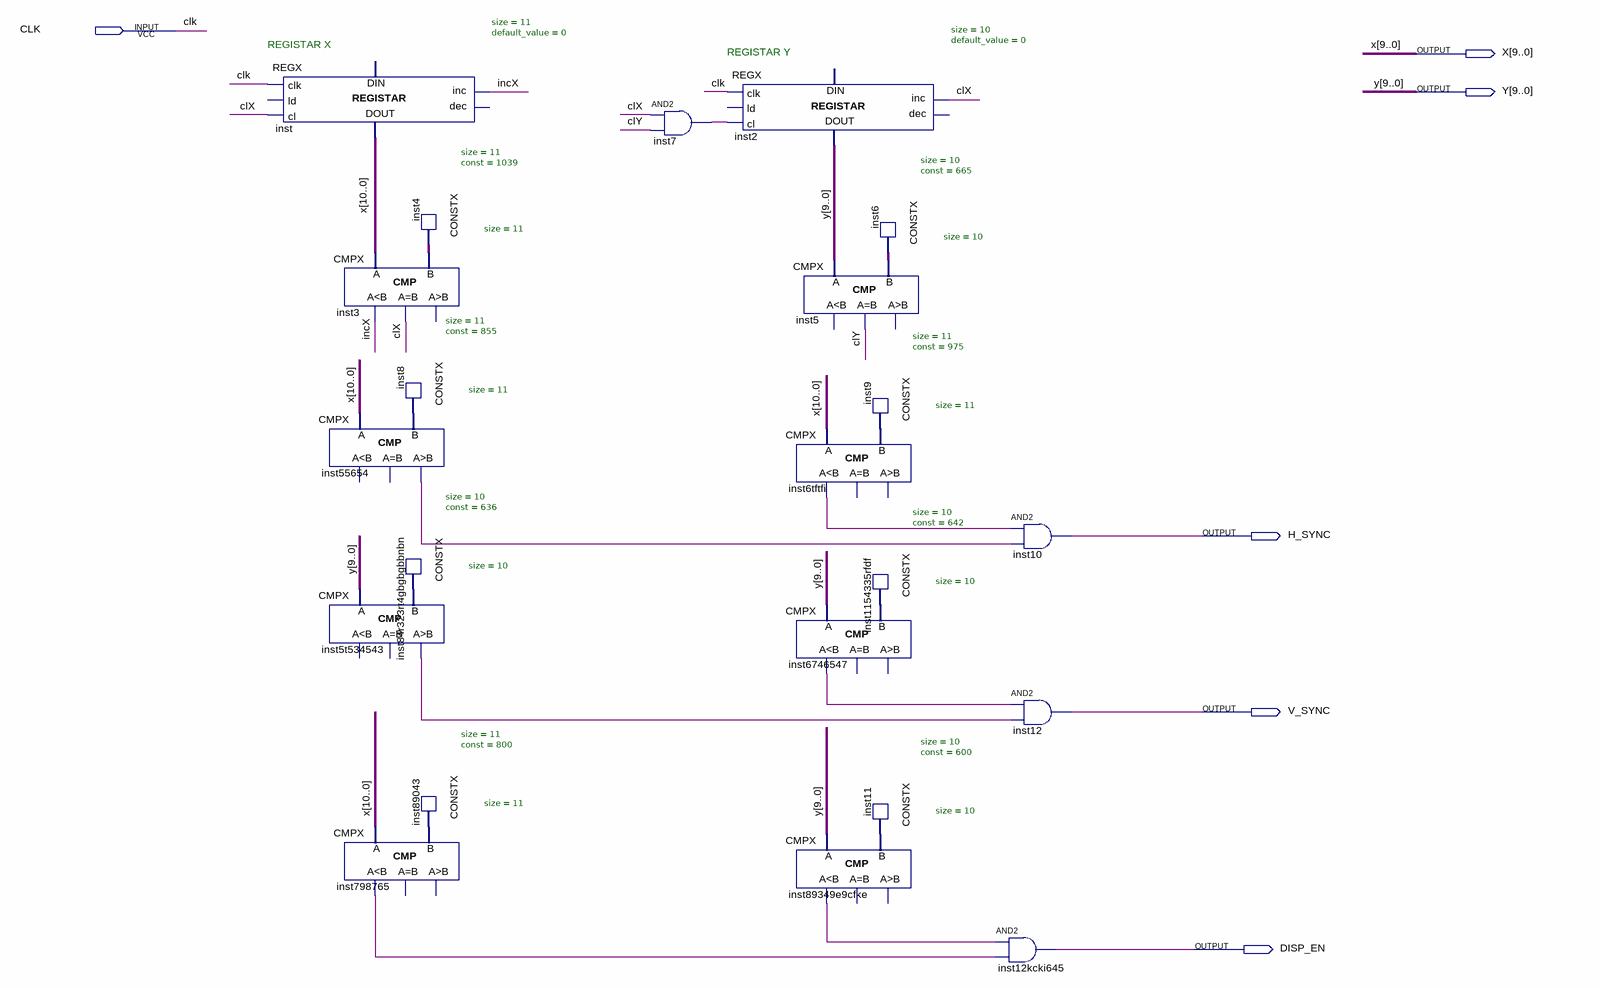
[diagram p0: schematic sheet]
// Quartus schematic VGAController.bdf as structural Verilog: 22 symbols, 6 pins
module VGAController (
  input  CLK,
  output [10:0] X,
  output [9:0] Y,
  output H_SYNC,
  output V_SYNC,
  output DISP_EN
);

  wire clX, clY, incX, inst5t534543_gr, inst6tftfi_ls, inst7_out, inst55654_gr, inst89349e9cfke_ls,
       inst798765_ls, inst6746547_ls;
  wire [9:0] inst6_data, inst11_data, inst84r323rt4gbgbgbbnbn_data, inst1154335rfdf_data;
  wire [10:0] inst4_data, inst8_data, inst9_data, inst89043_data;

  REGX #(.size(11), .default_value(0)) inst (.clk(CLK), .cl(clX), .inc(incX), .data_out(X));  // open: ld, dec, data_in
  CMPX #(.size(11)) inst3 (.A(X), .B(inst4_data), .ls(incX), .eq(clX));  // open: gr
  CMPX #(.size(11)) inst55654 (.A(X), .B(inst8_data), .gr(inst55654_gr));  // open: ls, eq
  CMPX #(.size(10)) inst5t534543 (.A(Y), .B(inst84r323rt4gbgbgbbnbn_data), .gr(inst5t534543_gr));  // open: ls, eq
  CMPX #(.size(11)) inst798765 (.A(X), .B(inst89043_data), .ls(inst798765_ls));  // open: eq, gr
  CONSTX #(.size(11), .\const (1039)) inst4 (.data(inst4_data));
  CONSTX #(.size(11), .\const (855)) inst8 (.data(inst8_data));
  CONSTX #(.size(10), .\const (636)) inst84r323rt4gbgbgbbnbn (.data(inst84r323rt4gbgbgbbnbn_data));
  CONSTX #(.size(11), .\const (800)) inst89043 (.data(inst89043_data));
  and inst7 (inst7_out, clX, clY);
  REGX #(.size(10), .default_value(0)) inst2 (
    .clk(CLK), .cl(inst7_out), .inc(clX), .data_out(Y));  // open: ld, dec, data_in
  CMPX #(.size(10)) inst5 (.A(Y), .B(inst6_data), .eq(clY));  // open: ls, gr
  CMPX #(.size(11)) inst6tftfi (.A(X), .B(inst9_data), .ls(inst6tftfi_ls));  // open: eq, gr
  CMPX #(.size(10)) inst6746547 (.A(Y), .B(inst1154335rfdf_data), .ls(inst6746547_ls));  // open: eq, gr
  CMPX #(.size(10)) inst89349e9cfke (.A(Y), .B(inst11_data), .ls(inst89349e9cfke_ls));  // open: eq, gr
  CONSTX #(.size(10), .\const (665)) inst6 (.data(inst6_data));
  CONSTX #(.size(11), .\const (975)) inst9 (.data(inst9_data));
  CONSTX #(.size(10), .\const (642)) inst1154335rfdf (.data(inst1154335rfdf_data));
  CONSTX #(.size(10), .\const (600)) inst11 (.data(inst11_data));
  and inst10 (H_SYNC, inst6tftfi_ls, inst55654_gr);
  and inst12 (V_SYNC, inst6746547_ls, inst5t534543_gr);
  and inst12kcki645 (DISP_EN, inst89349e9cfke_ls, inst798765_ls);

  // Notes on the sheet:
  //   REGISTAR X
  //   REGISTAR Y
endmodule
